# Altium schematic sheet Analog.SchDoc: uSDR schematic
size Letter; Author: Ye-sheng Kuo; CompanyName: Univ. of Michigan; Revision: 2.0; SheetNumber: 13; SheetTotal: 16
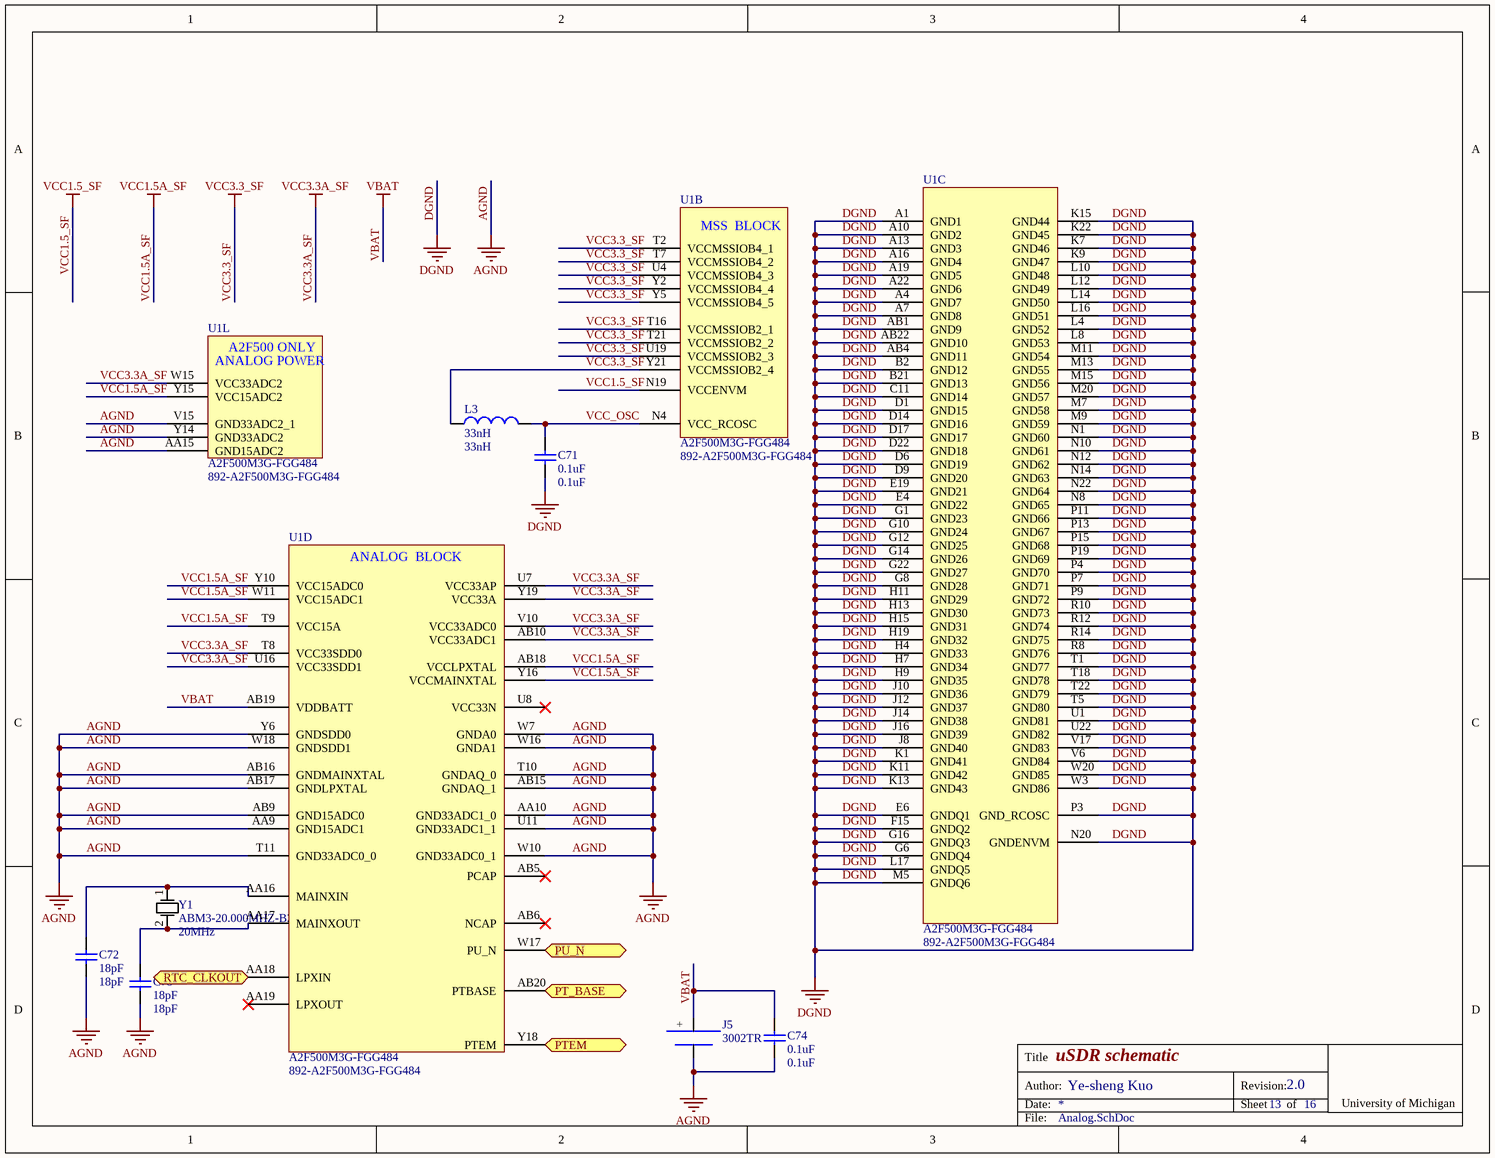
[diagram p0: Analog.SchDoc]

## Parts
C71  0.1uF  [0402]
C72  18pF  [0402]
C73  18pF  [0402]
C74  0.1uF  [0402]
J5  3002TR  [3002TR]
L3  33nH  [0402]
U1  A2F500M3G-FGG484  Supplier Part Number 1: 892-A2F500M3G-FGG484  [BGA100P22X22-484N]  (parts B,C,D,L of 13)
Y1  ABM3-20.000MHZ-B2-T  value 20MHz  [ABM3]

## Ports
PT_BASE, PTEM, PU_N, RTC_CLKOUT

## Nets
AGND: C72.1 C73.1 C74.1 J5.neg(-) U1.AA9(GND15ADC1) U1.AA10(GND33ADC1_0) U1.AA15(GND15ADC2) U1.AB9(GND15ADC0) U1.AB15(GNDAQ_1) U1.AB16(GNDMAINXTAL) U1.AB17(GNDLPXTAL) U1.T10(GNDAQ_0) U1.T11(GND33ADC0_0) U1.U11(GND33ADC1_1) U1.V15(GND33ADC2_1) U1.W7(GNDA0) U1.W10(GND33ADC0_1) U1.W16(GNDA1) U1.W18(GNDSDD1) U1.Y6(GNDSDD0) U1.Y14(GND33ADC2)
DGND: C71.1 U1.A1(GND1) U1.A4(GND7) U1.A7(GND8) U1.A10(GND2) U1.A13(GND3) U1.A16(GND4) U1.A19(GND5) U1.A22(GND6) U1.AB1(GND9) U1.AB4(GND11) U1.AB22(GND10) U1.B2(GND12) U1.B21(GND13) U1.C11(GND14) U1.D1(GND15) U1.D6(GND19) U1.D9(GND20) U1.D14(GND16) U1.D17(GND17) U1.D22(GND18) U1.E4(GND22) U1.E6(GNDQ1) U1.E19(GND21) U1.F15(GNDQ2) U1.G1(GND23) U1.G6(GNDQ4) U1.G8(GND28) U1.G10(GND24) U1.G12(GND25) U1.G14(GND26) U1.G16(GNDQ3) U1.G22(GND27) U1.H4(GND33) U1.H7(GND34) U1.H9(GND35) U1.H11(GND29) U1.H13(GND30) U1.H15(GND31) U1.H19(GND32) U1.J8(GND40) U1.J10(GND36) U1.J12(GND37) U1.J14(GND38) U1.J16(GND39) U1.K1(GND41) U1.K7(GND46) U1.K9(GND47) U1.K11(GND42) U1.K13(GND43) U1.K15(GND44) U1.K22(GND45) U1.L4(GND52) U1.L8(GND53) U1.L10(GND48) U1.L12(GND49) U1.L14(GND50) U1.L16(GND51) U1.L17(GNDQ5) U1.M5(GNDQ6) U1.M7(GND58) U1.M9(GND59) U1.M11(GND54) U1.M13(GND55) U1.M15(GND56) U1.M20(GND57) U1.N1(GND60) U1.N8(GND65) U1.N10(GND61) U1.N12(GND62) U1.N14(GND63) U1.N20(GNDENVM) U1.N22(GND64) U1.P3(GND_RCOSC) U1.P4(GND70) U1.P7(GND71) U1.P9(GND72) U1.P11(GND66) U1.P13(GND67) U1.P15(GND68) U1.P19(GND69) U1.R8(GND76) U1.R10(GND73) U1.R12(GND74) U1.R14(GND75) U1.T1(GND77) U1.T5(GND80) U1.T18(GND78) U1.T22(GND79) U1.U1(GND81) U1.U22(GND82) U1.V6(GND84) U1.V17(GND83) U1.W3(GND86) U1.W20(GND85)
VBAT: C74.2 J5.pos(+) U1.AB19(VDDBATT)
VCC1.5_SF: U1.N19(VCCENVM)
VCC1.5A_SF: U1.AB18(VCCLPXTAL) U1.T9(VCC15A) U1.W11(VCC15ADC1) U1.Y10(VCC15ADC0) U1.Y15(VCC15ADC2) U1.Y16(VCCMAINXTAL)
VCC3.3_SF: L3.1 U1.T2(VCCMSSIOB4_1) U1.T7(VCCMSSIOB4_2) U1.T16(VCCMSSIOB2_1) U1.T21(VCCMSSIOB2_2) U1.U4(VCCMSSIOB4_3) U1.U19(VCCMSSIOB2_3) U1.Y2(VCCMSSIOB4_4) U1.Y5(VCCMSSIOB4_5) U1.Y21(VCCMSSIOB2_4)
VCC3.3A_SF: U1.AB10(VCC33ADC1) U1.T8(VCC33SDD0) U1.U7(VCC33AP) U1.U16(VCC33SDD1) U1.V10(VCC33ADC0) U1.W15(VCC33ADC2) U1.Y19(VCC33A)
PT_BASE: U1.AB20(PTBASE) ; port PT_BASE
PTEM: U1.Y18(PTEM) ; port PTEM
PU_N: U1.W17(PU_N) ; port PU_N
RTC_CLKOUT: U1.AA18(LPXIN) ; port RTC_CLKOUT
VCC_OSC: C71.2 L3.2 U1.N4(VCC_RCOSC)
NetC72_2: C72.2 U1.AA16(MAINXIN) Y1.1(HOT)
NetC73_2: C73.2 U1.AA17(MAINXOUT) Y1.2(HOT)

Not connected (* = marked no-connect by the designer): U1 AA19(LPXOUT)* AB5(PCAP)* AB6(NCAP)* U8(VCC33N)*

## Notes on the sheet
- Title
- Date:
- Author:
- Revision:
- Sheet
- of
- University of Michigan
- File:
- (in symbol F2-200_500-FGG484_1, part B) MSS  BLOCK
- (in symbol F2-200_500-FGG484_1, part D) ANALOG  BLOCK
- (in symbol F2-200_500-FGG484_1, part L) A2F500 ONLY; ANALOG POWER

## Library data of the parts
C71-C74 = Cap Semi: Capacitor (Semiconductor SIM Model); Published: 8-Jun-2000; LatestRevisionDate: 29-May-2009; LatestRevisionNote: IPC-7351 Footprint Added.; PackageReference: C1206; Publisher: Altium Limited; PackageDescription: Chip Capacitor
  C71 C74: Value: 0.1uF
  C72 C73: Value: 18pF
J5 = 3002TR: HOLDER BATTERY COIN 20MM DIA SMD; datasheet: http://mail.keyelco.com/ENG._DEPT/PDF%20CAT%20NO%20Drawings/3002.pdf; Supplier 1: Digi-Key; Supplier Part Number 1: 3002KCT-ND
L3 = Inductor: Code_IEC: 1005; Published: 8-Jun-2000; LatestRevisionDate: 29-May-2009; LatestRevisionNote: IPC-7351 Footprint Added.; PackageReference: 0402-A; Publisher: Altium Limited; PackageDescription: Chip Inductor; Code_JEITA: 0402; Value: 33nH
U1 = F2-200_500-FGG484_1: FPGA - Field Programmable Gate Array 500K System Gates; PPS#: P0934R; Supplier 1: Mouser
Y1 = ABM3: CRYSTAL 20.000MHZ 18PF SMD; Supplier 1: Digi-Key; Supplier Part Number 1: 535-9105-1-ND